# EAGLE board MotorShield (EAGLE 9.0.1)
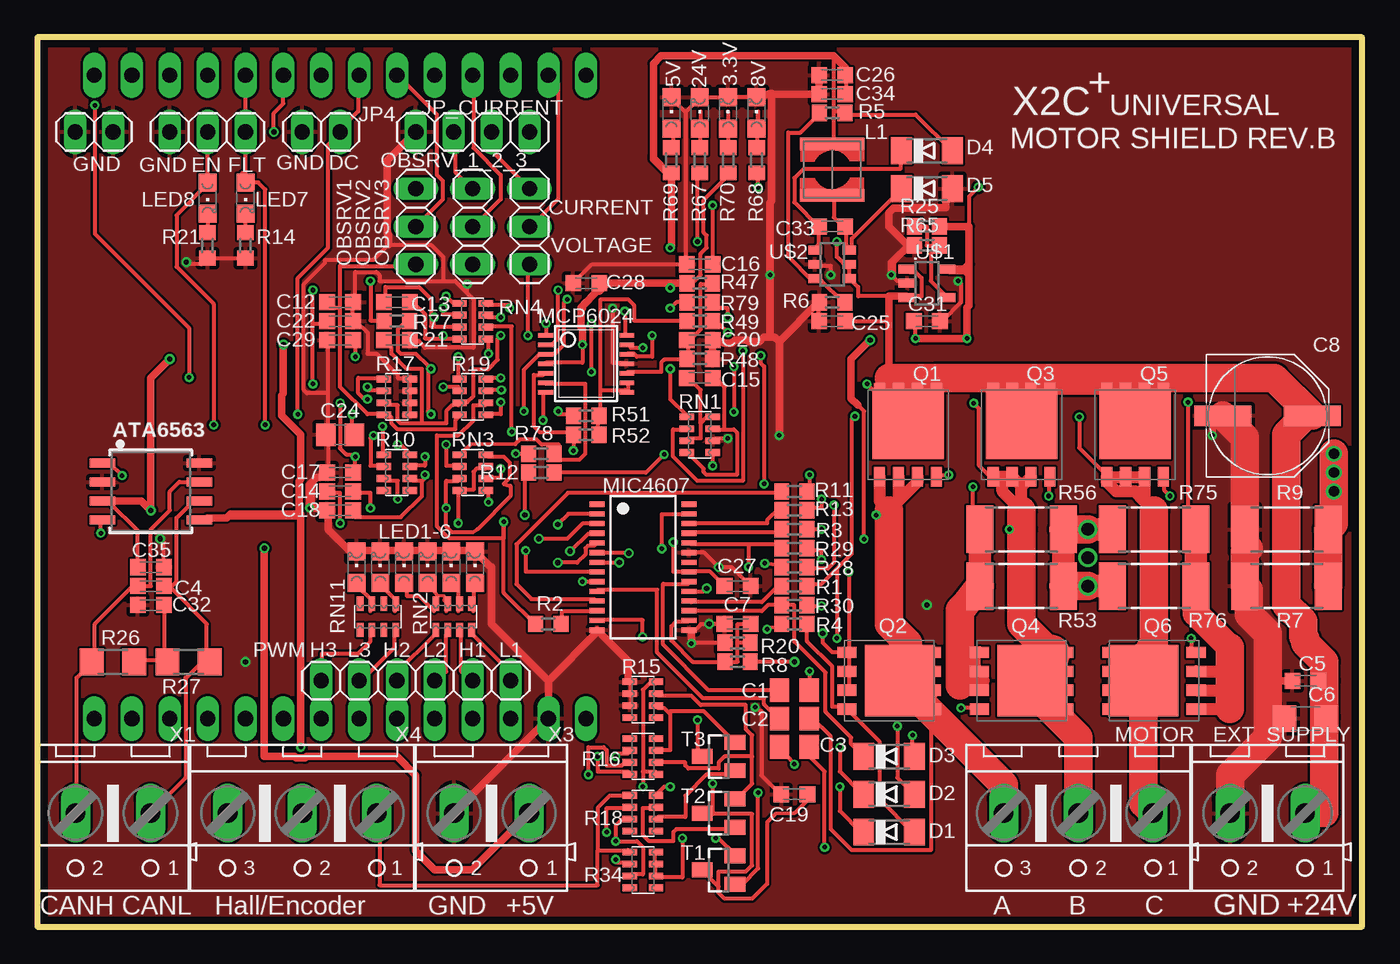
[diagram p2: board, top side]
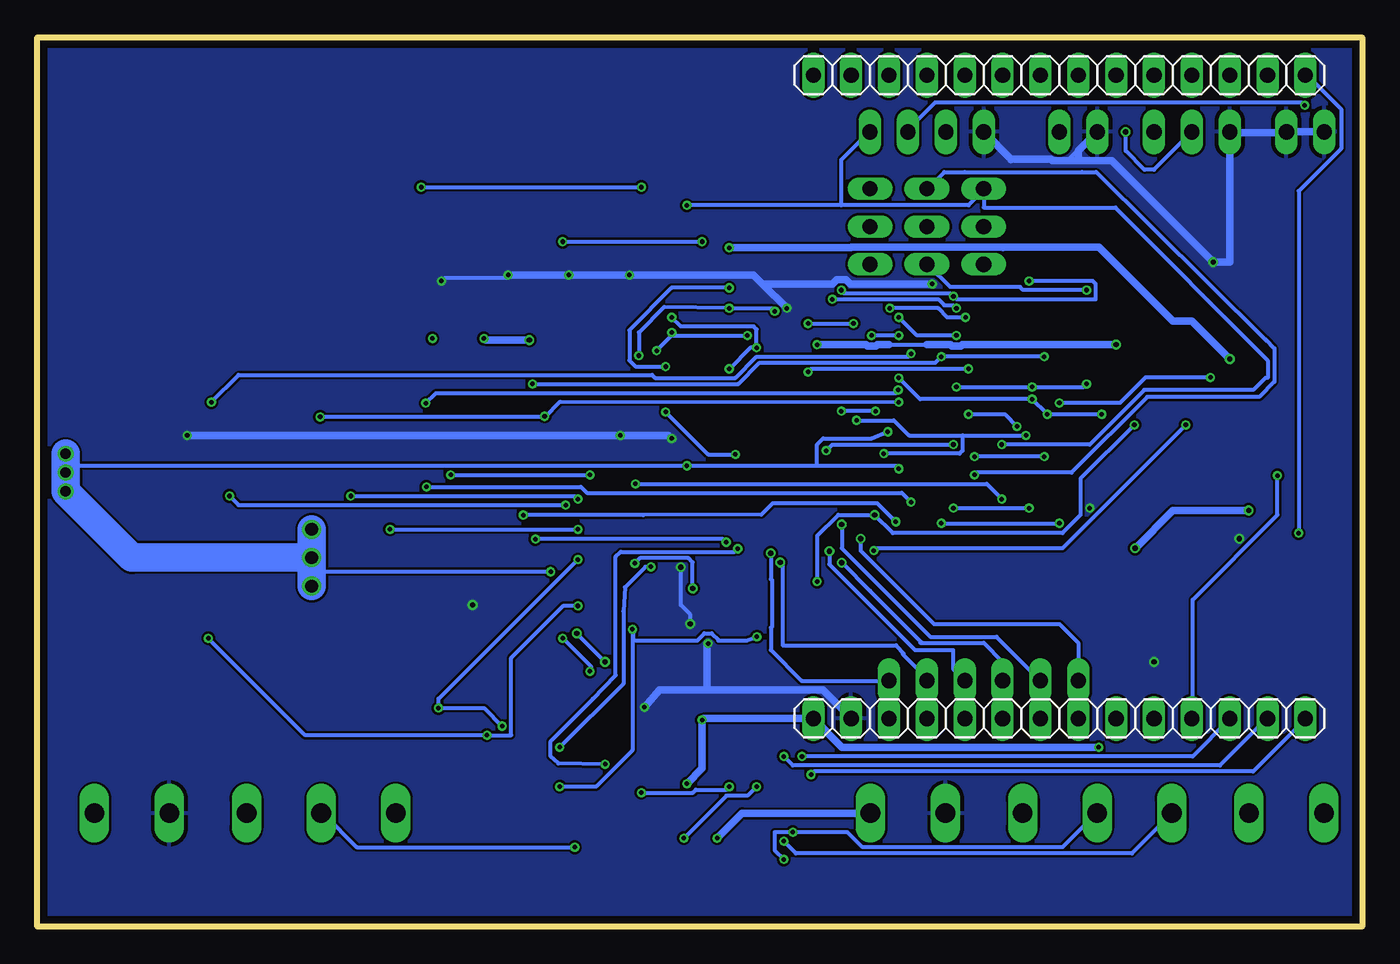
[diagram p3: board, bottom side, seen from below]

Size 88.9 x 59.69 mm. Coordinates in mm from the lower left corner, seen from the top.
Outline: 0,0 88.9,0 88.9,59.69 0,59.69 0,0
Copper layers (1*16): Top 0.035mm / dielectric 1.6mm / Bottom 0.035mm
Design rules "Elecrow_2-layer_PCB_eagle_rule *": minimum track width 10mil, minimum drill 12mil, track to track 6mil, track to pad 6mil, pad to pad 6mil, via to via 8mil, smd to smd 0mil, copper to edge 20mil, drill to drill 10mil, minimum pad ring 6mil, minimum via ring 6mil, stop-mask expansion 0mil, vias tented up to drill 100mil, thermal gap 10mil

## Footprints (pad centres in the part's own frame; a part is rotated, then mirrored left to right if it is on the bottom)
CHIPLED_0805 = smd 1.2 x 1.2: A 0,-1.05; C 0,1.05
SOIC-8 = smd 0.61 x 1.702: 1 -1.905,-3.251; 2 -0.635,-3.251; 3 0.635,-3.251; 4 1.905,-3.251; 5 1.905,3.251; 6 0.635,3.251; 7 -0.635,3.251; 8 -1.905,3.251
C0805K = smd 1.3 x 1.6: 1 -1,0; 2 1,0
C0603K = smd 1.05 x 1.08: 1 -0.875,0; 2 0.875,0
C1206 = smd 1.6 x 1.8: 1 -1.4,0; 2 1.4,0
PANASONIC_E = smd 3.8 x 1.4: + 3,0; - -3,0
C0805 = smd 1.3 x 1.5: 1 -0.95,0; 2 0.95,0
MINIMELF = smd 1.4 x 1.8: A 1.7,0; C -1.7,0
CLL5.08/2 = drill 1.321 long: 1 -2.515,0; 2 2.515,0
1X03 = drill 1.016 long: 1 -2.54,0; 2 0,0; 3 2.54,0
1X02 = drill 1.016 long: 1 -1.27,0; 2 1.27,0
1X04 = drill 1.016 long: 1 -3.81,0; 2 -1.27,0; 3 1.27,0; 4 3.81,0
WE-TPC_3816 = smd 0.85 x 4.3: 1 -1.731,0; 2 1.731,0
1X14 = drill 1.016 long: 1 -16.51,0; 2 -13.97,0; 3 -11.43,0; 4 -8.89,0; 5 -6.35,0; 6 -3.81,0; 7 -1.27,0; 8 1.27,0; 9 3.81,0; 10 6.35,0; 11 8.89,0; 12 11.43,0; 13 13.97,0; 14 16.51,0
TSSOP14 = smd 0.305 x 0.991: 1 -1.905,-2.718; 2 -1.27,-2.718; 3 -0.635,-2.718; 4 0,-2.718; 5 0.635,-2.718; 6 1.27,-2.718; 7 1.905,-2.718; 8 1.905,2.718; 9 1.27,2.718; 10 0.635,2.718; 11 0,2.718; 12 -0.635,2.718; 13 -1.27,2.718; 14 -1.905,2.718
TSSOP28 = smd 0.35 x 1: 1 -4.225,-3.087; 2 -3.575,-3.087; 3 -2.925,-3.087; 4 -2.275,-3.087; 5 -1.625,-3.087; 6 -0.975,-3.087; 7 -0.325,-3.087; 8 0.325,-3.087; 9 0.975,-3.087; 10 1.625,-3.087; 11 2.275,-3.087; 12 2.925,-3.087; 13 3.575,-3.087; 14 4.225,-3.087; 15 4.225,3.087; 16 3.575,3.087; 17 2.925,3.087; 18 2.275,3.087; 19 1.625,3.087; 20 0.975,3.087; 21 0.325,3.087; 22 -0.325,3.087; 23 -0.975,3.087; 24 -1.625,3.087; 25 -2.275,3.087; 26 -2.925,3.087; 27 -3.575,3.087; 28 -4.225,3.087
CLL5.08/3 = drill 1.321 long: 1 -5.004,0; 2 0,0; 3 5.004,0
1X06 = drill 1.016 long: 1 -6.35,0; 2 -3.81,0; 3 -1.27,0; 4 1.27,0; 5 3.81,0; 6 6.35,0
PG-TDSON-8_ = smd 1.3 x 0.75: 1 -2.825,1.905; 2 -2.825,0.635; 3 -2.825,-0.635; 4 -2.825,-1.905; 5 2.825,-1.905; 6 2.825,-0.635; 7 2.825,0.635; 8 2.825,1.905 | smd 4.7 x 4.8: TH 0.725,0
R0603 = smd 1 x 1.1: 1 -0.85,0; 2 0.85,0
R2512 = smd 1.8 x 3.2: 1 -2.8,0; 2 2.8,0
EXBV8V_A = smd 0.45 x 0.965: 1 -1.2,-0.876; 2 -0.4,-0.876; 3 0.4,-0.876; 4 1.2,-0.876; 5 1.2,0.876; 6 0.4,0.876; 7 -0.4,0.876; 8 -1.2,0.876
R1206 = smd 1.6 x 1.803: 1 -1.422,0; 2 1.422,0
SOT23 = smd 1 x 1.4: 1 -0.95,-1.1; 2 0.95,-1.1; 3 0,1.1
TSOT23-5 = smd 0.6 x 1.2: 1 -0.95,-1.3; 2 0,-1.3; 3 0.95,-1.3; 4 0.95,1.3; 5 -0.95,1.3
SOT23-6 = smd 0.6 x 0.9: 1 -0.95,-1.15; 2 0,-1.15; 3 0.95,-1.15; 4 0.95,1.15; 5 0,1.15; 6 -0.95,1.15

## Placement (x,y rotation side)
3.3V  Green  [CHIPLED_0805]  46.35,54.61 0 top
5V  Green  [CHIPLED_0805]  42.55,54.61 0 top
8V  Green  [CHIPLED_0805]  48.26,54.61 0 top
24V  Green  [CHIPLED_0805]  44.45,54.61 0 top
ATA6563  ATA6563  [SOIC-8]  7.62,29.21 270 top
C1  10uF  [C0805K]  50.8,15.88 0 top
C2  10uF  [C0805K]  50.8,13.97 0 top
C3  10uF  [C0805K]  50.8,12.06 0 top
C4  22pF  [C0603K]  7.62,22.86 0 top
C5  100nF  [C0603K]  85.09,16.51 180 top
C6  10uF  [C1206]  85.09,13.97 180 top
C7  1nF  [C0603K]  46.99,20.32 180 top
C8  470u 63V  [PANASONIC_E]  82.55,34.29 0 top
C12  22nF  [C0603K]  20.32,41.91 0 top
C13  1nF  [C0603K]  24.13,41.91 180 top
C14  1nF  [C0603K]  20.32,29.21 0 top
C15  1nF  [C0603K]  44.45,36.83 180 top
C16  1nF  [C0603K]  44.45,44.45 180 top
C17  1nF  [C0603K]  20.32,30.48 180 top
C18  1nF  [C0603K]  20.32,27.94 180 top
C19  1uF  [C0603K]  50.8,8.89 180 top
C20  22nF  [C0603K]  44.45,39.37 0 top
C21  22nF  [C0603K]  24.13,39.37 0 top
C22  22nF  [C0603K]  20.32,40.64 0 top
C24  100n  [C0805]  20.32,33.02 0 top
C25  100nF  [C0603K]  53.34,40.64 180 top
C26  1uF  [C0603K]  53.34,57.15 180 top
C27  100nF  [C0603K]  46.99,22.86 0 top
C28  100nF  [C0603K]  36.83,43.18 180 top
C29  100nF  [C0603K]  20.32,39.37 180 top
C31  4,7uF  [C0603K]  59.69,40.64 0 top
C32  22nF  [C0603K]  7.62,21.59 0 top
C33  100nF  [C0603K]  53.34,46.99 0 top
C34  4,7uF  [C0603K]  53.34,55.88 180 top
C35  4,7uF  [C0603K]  7.62,24.13 0 top
D1  40V  [MINIMELF]  57.15,6.35 0 top
D2  40V  [MINIMELF]  57.15,8.89 0 top
D3  40V  [MINIMELF]  57.15,11.43 0 top
D4  ll4148  [MINIMELF]  59.69,52.07 0 top
D5  40V  [MINIMELF]  59.69,49.53 0 top
EXT_SUPPLY  CLL5.08/2  [CLL5.08/2]  82.55,7.62 180 top
FLT/EN_TP  [1X03]  11.43,53.34 180 top
GND  [1X02]  3.81,53.34 180 top
JP4  [1X02]  19.05,53.34 180 top
JP_CURRENT  [1X04]  29.21,53.34 180 top
L1  4,7uH  [WE-TPC_3816]  53.34,50.8 90 top
LED1  Yellow  [CHIPLED_0805]  29.37,24.13 0 top
LED2  Yellow  [CHIPLED_0805]  27.78,24.13 0 top
LED3  Yellow  [CHIPLED_0805]  26.19,24.13 0 top
LED4  Yellow  [CHIPLED_0805]  24.61,24.13 0 top
LED5  Yellow  [CHIPLED_0805]  23.02,24.13 0 top
LED6  Yellow  [CHIPLED_0805]  21.43,24.13 0 top
LED7  Red  [CHIPLED_0805]  13.97,48.9 180 top
LED8  Red  [CHIPLED_0805]  11.43,48.9 180 top
LEFT  [1X14]  20.32,57.15 0 bottom
MCP6024  MCP6004ST  [TSSOP14]  36.83,37.78 270 top
MIC4607  MIC4607-1  [TSSOP28]  40.64,24.13 270 top
MOTOR  CLL5.08/3  [CLL5.08/3]  69.85,7.62 180 top
OBSRV1  [1X03]  25.4,46.99 270 top
OBSRV2  [1X03]  33.02,46.99 270 top
OBSRV3  [1X03]  29.21,46.99 270 top
PWM_TEST_POINTS  [1X06]  25.4,16.51 180 top
Q1  DMT4002LPS  [PG-TDSON-8_]  58.42,33.02 90 top
Q2  DMT4002LPS  [PG-TDSON-8_]  57.15,16.51 0 top
Q3  DMT4002LPS  [PG-TDSON-8_]  66.04,33.02 90 top
Q4  DMT4002LPS  [PG-TDSON-8_]  66.04,16.51 0 top
Q5  DMT4002LPS  [PG-TDSON-8_]  73.66,33.02 90 top
Q6  DMT4002LPS  [PG-TDSON-8_]  74.93,16.51 180 top
R1  10R  [R0603]  50.8,22.86 0 top
R2  10R  [R0603]  34.29,20.32 180 top
R3  10R  [R0603]  50.8,26.67 0 top
R4  10R  [R0603]  50.8,20.32 0 top
R5  68k 1%  [R0603]  53.34,54.61 0 top
R6  12k 1%  [R0603]  53.34,41.91 180 top
R7  R-EU_SMDR2512  [R2512]  83.82,22.86 0 top
R8  680R  [R0603]  46.99,17.78 180 top
R9  R-EU_SMDR2512  [R2512]  83.82,26.67 0 top
R10  2,2k  [EXBV8V_A]  24.13,30.48 270 top
R11  0R  [R0603]  50.8,29.21 0 top
R12  22k 1%  [R0603]  33.81,30.48 0 top
R13  0R  [R0603]  50.8,27.94 0 top
R14  680R  [R0603]  13.97,45.72 90 top
R15  2,2k  [EXBV8V_A]  40.64,15.24 270 top
R16  200R  [EXBV8V_A]  40.64,11.43 90 top
R17  2,2k  [EXBV8V_A]  24.13,35.56 90 top
R18  2,2k  [EXBV8V_A]  40.64,7.62 270 top
R19  22k  [EXBV8V_A]  29.21,35.56 90 top
R20  680R  [R0603]  46.99,19.05 180 top
R21  680R  [R0603]  11.43,45.72 90 top
R25  68k 1%  [R0603]  59.69,46.99 0 top
R26  60R  [R1206]  5.09,17.78 0 top
R27  60R  [R1206]  10.15,17.78 180 top
R28  0R  [R0603]  50.8,24.13 0 top
R29  10R  [R0603]  50.8,25.4 180 top
R30  10R  [R0603]  50.8,21.59 180 top
R34  2,2k  [EXBV8V_A]  40.64,3.81 270 top
R47  2,2k  [R0603]  44.45,43.18 180 top
R48  2,2k  [R0603]  44.45,38.1 180 top
R49  22k 1%  [R0603]  44.45,40.64 0 top
R51  22k 1%  [R0603]  36.83,34.29 180 top
R52  22k 1%  [R0603]  36.83,33.02 180 top
R53  R-EU_SMDR2512  [R2512]  66.04,22.86 180 top
R56  R-EU_SMDR2512  [R2512]  66.04,26.67 180 top
R65  12k 1%  [R0603]  59.69,45.72 0 top
R67  12,4k 1%  [R0603]  44.45,51.44 270 top
R68  2,2k  [R0603]  48.26,51.44 270 top
R69  680R  [R0603]  42.55,51.44 270 top
R70  330R  [R0603]  46.35,51.44 270 top
R75  R-EU_SMDR2512  [R2512]  74.93,26.67 0 top
R76  R-EU_SMDR2512  [R2512]  74.93,22.86 0 top
R77  22k 1%  [R0603]  24.13,40.64 0 top
R78  22k 1%  [R0603]  33.81,31.75 180 top
R79  22k 1%  [R0603]  44.45,41.91 180 top
RIGHT  [1X14]  20.32,13.97 0 bottom
RN1  2,2k  [EXBV8V_A]  44.45,33.02 90 top
RN2  680R  [EXBV8V_A]  27.94,20.8 0 top
RN3  2,2k  [EXBV8V_A]  29.21,30.48 90 top
RN4  2,2k  [EXBV8V_A]  29.21,40.64 90 top
RN11  680R  [EXBV8V_A]  22.86,20.8 0 top
T1  BSS123  [SOT23]  45.72,3.81 90 top
T2  BSS123  [SOT23]  45.72,7.62 90 top
T3  BSS123  [SOT23]  45.72,11.43 90 top
U$1  MIC5233YM5  [TSOT23-5]  59.69,43.18 270 top
U$2  MCP16301T-E/CH  [SOT23-6]  53.34,44.45 270 top
X1  CLL5.08/2  [CLL5.08/2]  5.08,7.62 180 top
X3  CLL5.08/2  [CLL5.08/2]  30.48,7.62 180 top
X4  CLL5.08/3  [CLL5.08/3]  17.78,7.62 180 top

## Tracks (layer width: path | path; a pad name or v marks a point on that pad's centre or on a via)
+5V  (via drill 0.3, 0.35)
  Top 0.254: 41.34,51.73 42.47,50.6 R69.2 42.47,50.39 v42.47,45.57 | 41.91,58.44 41.86,58.44 | 53.44,54.71 53.44,52.68 L1.2 | 53.44,54.71 53.44,58.42 | 53.44,54.71 54.05,54.71 R5.2 54.25,54.51 58.93,54.51 61.37,52.07 D4.A | R34.8 41.45,4.93 41.45,4.32 R34.7 41.45,4.12 41.45,3.5 R34.6 41.66,3.3 43.28,3.3 v43.28,5.94 | C34.1 54.25,55.88 54.25,57.1 C26.1 | ATA6563.3 4.47,28.45 4.88,28.45 6.71,26.62 6.71,24.18 C35.1 6.71,23.98
  Top 0.508: C26.1 54.22,57.65 53.44,58.42 53.42,58.44 41.91,58.44 | 41.86,58.44 41.34,57.92 41.34,51.73 41.34,51.52 42.47,50.39 | R69.2 42.55,45.64 v42.47,45.57 | X3.1 29.18,3.81 26.67,3.81 25.4,5.08 25.4,10.16 24.13,11.43 18.07,11.43 17.97,11.33 17.38,11.33 17.28,11.43 15.24,11.43 v15.24,25.4 | ATA6563.3 6.99,28.57 v7.62,27.94 7.62,36.83 v8.89,38.1
  Bottom 0.508: v42.47,45.57 34.32,45.57 34.27,45.62 24.15,45.62 | 24.15,45.62 24.1,45.57 | X3.1 41.6,7.62 v43.28,5.94 | 24.15,45.62 17.68,45.62 12.7,40.64 11.43,40.64 v8.89,38.1 | v15.24,25.4 12.7,27.94 v7.62,27.94
+8V  (via drill 0.3, 0.35)
  Top 0.254: v48.36,49.63 48.36,50.39 R68.2 | v58.93,39.47 58.93,40.49 C31.1 58.73,40.49 | v62.38,39.47 62.38,43.74 62.18,43.94 61.16,43.94 U$1.5 | 43.69,23.82 42.67,23.82 v42.67,25.81 | 43.69,23.82 MIC4607.21 | 55.07,35 55.47,34.59 v55.47,26.01 | v63.14,49.63 62.51,49 62.51,46.99 | C27.1 45.15,23.82 43.69,23.82
  Top 0.508: v55.88,39.37 54.61,38.1 54.61,35.46 55.07,35 | v58.93,39.47 v62.38,39.47 62.38,41.56 62.51,41.69 62.51,44.45 | 62.51,44.45 62.51,46.99 R25.2 | U$1.5 62.19,44.13 62.51,44.45
  Bottom 0.254: v63.14,49.63 v48.36,49.63 | v55.47,26.01 42.88,26.01 v42.67,25.81
  Bottom 0.508: v58.93,39.47 58.83,39.37 v55.88,39.37
+24V  (via drill 0.3)
  Top 0.254: v28.25,38.25 28.25,36.83 R19.5 | v21.34,38.25 21.34,39.27 C29.1 | 57.71,35.81 56.69,35.81 Q1.8 56.49,36.02 56.08,36.02 v55.68,36.42 | 57.71,35.81 Q1.7 | 57.71,35.81 Q1.TH | Q1.TH 58.12,35 58.93,35.81 Q1.6 59.13,35.81 60.15,35.81 Q1.5 | 85.95,16.51 C5.1 86.36,16.51 | C6.1 86.56,14.07 86.36,14.07 | 65.23,35.81 64.21,35.81 Q3.8 | 65.23,35.81 Q3.7 | 65.23,35.81 Q3.TH 67.87,35.81 | 67.87,35.81 66.85,35.81 Q3.6 | 67.87,35.81 Q3.5 68.07,35.81 71.73,35.81 Q5.8 71.93,35.81 72.95,35.81 | 72.95,35.81 Q5.7 | 72.95,35.81 Q5.TH 73.36,35 74.17,35.81 Q5.6 74.37,35.81 75.39,35.81 Q5.5 75.59,35.81 | U$1.3 58.52,42.32 59.33,42.32 59.33,43.54 58.93,43.94 58.52,43.94 U$1.1 | 54.46,44.15 54.46,44.35 U$2.5 | 54.46,44.15 54.46,43.54 U$2.4 54.66,43.33 55.07,42.93 55.07,42.32 57.15,42.32 | v44.3,45.97 44.3,50.39 R67.2 | v53.65,45.97 53.65,44.96 54.46,44.15 | 64.01,36.02 Q3.8 | 60.35,36.83 60.35,36.02 Q1.TH | Q3.8 64.21,35.97 64.21,36.83 | C25.1 57.15,40.64
  Top 0.508: U$1.3 58.3,42.32 57.15,42.32 57.15,40.64 57.15,36.83
  Top 1.905: EXT_SUPPLY.1 86.36,7.64 86.36,14.07 86.36,16.51 86.36,17.78 85.09,19.05 85.09,19.32 84.94,19.47 84.94,20.47 83.82,21.59 83.82,33.02 85.09,34.29 C8.+ 83.01,36.83 64.21,36.83 60.35,36.83 57.15,36.83
  Bottom 0.254: v21.34,38.25 v28.25,38.25 28.65,37.85 40.44,37.85 41.86,36.42 v55.68,36.42 | v53.65,45.97 v44.3,45.97
AHB
  Top 0.254: C1.1 45.05,15.88 41.99,18.93 41.99,23.01 43.69,23.01 MIC4607.20
AHO  (via drill 0.3, 0.35)
  Top 0.254: v48.81,24.39 49.78,24.23 R28.1 | MIC4607.19 44.73,22.5 v44.93,22.7
  Bottom 0.254: v44.93,22.7 44.93,24.45 45.22,24.74 48.47,24.74 v48.81,24.39
AHS
  Top 0.254: MIC4607.18 43.89,21.79 48.62,21.79 49.63,22.81 49.78,22.81 R1.1
ALO
  Top 0.254: MIC4607.17 43.89,21.18 48.62,21.18 49.02,21.59 R30.2 50.8,21.59 50.8,19.14 52.89,17.05 52.89,14.42 54.61,12.7 54.61,12.27 D3.C 55.27,11.43
BHB
  Top 0.254: MIC4607.10 37.59,22.61 41.59,22.61 41.59,18.41 44.66,15.34 48.77,15.34 48.77,14.93 49.62,14.07 C2.1
BHO
  Top 0.254: MIC4607.11 37.39,22 33.16,22 32.16,23 32.16,25.67 35.6,29.11 49.78,29.11 R11.1
BHS
  Top 0.254: MIC4607.12 37.39,21.18 35.2,21.18 35.2,20.32 R2.1
BLO  (via drill 0.3)
  Top 0.254: v40.62,19.46 40.62,20.57 37.59,20.57 MIC4607.13 | v48.97,19.96 48.97,20.08 49.78,20.06 R4.1 | v53.85,9.4 53.85,7.77 55.27,6.35 D1.C
  Bottom 0.254: v40.62,19.46 41.31,19.2 43.2,19.2 43.2,19.23 43.66,19.68 44.13,19.68 44.61,19.21 48.91,19.21 48.91,20.12 v48.97,19.96 48.97,11.84 51.41,9.4 v53.85,9.4
CAN_H
  Top 0.254: R26.1 3.66,17.73 2.64,16.71 2.64,7.77 X1.2 | 3.86,17.93 R26.1 | R26.1 3.86,17.88 3.86,20.32 6.3,22.76 6.71,22.76 C4.1 7.62,22.86 7.62,26.67 8.89,27.94 8.89,29.21 9.53,29.84 ATA6563.7 10.77,29.67
CAN_L
  Top 0.254: 9.96,16.71 9.96,16.66 | 9.96,16.66 9.96,10.01 7.72,7.77 X1.1 | 8.94,22.76 8.53,22.76 C4.2 8.94,22.76 | 8.94,22.76 11.38,20.32 11.38,17.88 R27.1 11.38,17.68 10.97,17.68 9.96,16.66 | 8.94,22.76 9.35,23.16 9.35,27.43 10.36,28.45 10.77,28.45 ATA6563.6
CHB  (via drill 0.3)
  Top 0.254: v41.9,25.37 41.9,27.69 43.69,27.69 MIC4607.27 | v50.8,10.9 49.99,11.84 49.99,11.43 C3.1
  Bottom 0.254: v41.9,25.37 42.11,25.16 49.77,25.16 50.09,24.84 50.09,16.88 51.61,15.29 54.46,12.45 54.46,11.43 53.92,10.95 v50.8,10.9
CHO
  Top 0.254: MIC4607.26 43.89,27.08 48.97,27.08 48.97,27.28 49.78,28.09 R13.1
CHS
  Top 0.254: MIC4607.25 43.89,26.47 49.78,26.47 49.78,26.67 R3.1
CLO  (via drill 0.3)
  Top 0.254: 47.73,25.65 49.78,25.65 49.78,25.45 R29.2 | 47.73,25.65 43.89,25.65 MIC4607.24 | v53.85,12.04 53.85,10.41 55.27,8.99 D2.C | 47.73,25.65 v47.73,24.15
  Bottom 0.254: v53.85,12.04 49.58,16.31 49.58,21.18 49.47,22.77 48.09,24.15 v47.73,24.15
DC_BUS  (via drill 0.3)
  Top 0.254: LEFT.7 21.54,57.15 21.54,54.71 20.32,53.49 JP4.1 20.32,53.29 19.51,52.48 19.51,45.57 17.48,43.54 v17.48,34.39 | v22.15,35.41 21.95,35.41 21.54,35.81 21.54,36.83 23.16,36.83 R17.5 | v21.13,34.39 21.13,33.17 C24.2 | v31.09,36.83 30.28,36.83 R19.4
  Bottom 0.254: v31.09,36.83 29.67,35.41 v22.15,35.41 v21.13,34.39 v17.48,34.39
EN  (via drill 0.3, 0.35)
  Top 0.254: v32.77,25.25 32.77,23.82 37.39,23.82 MIC4607.8 | 11.38,53.24 FLT/EN_TP.2 | 11.58,53.44 FLT/EN_TP.2 | FLT/EN_TP.2 LED8.A 11.38,49.78 9.35,47.75 9.35,44.3 11.84,41.81 v11.84,33.68 | v15.88,53.34 15.88,54.61 16.51,55.24 LEFT.9
  Bottom 0.254: FLT/EN_TP.2 13.97,50.8 14.61,50.8 15.88,52.07 v15.88,53.34 | v11.84,33.68 20.12,25.4 32.72,25.4 v32.77,25.25
FLT  (via drill 0.3, 0.35)
  Top 0.254: 37.59,23.22 MIC4607.9 37.39,23.16 v36.58,23.16 | 13.75,50.58 LED7.A | LED7.A FLT/EN_TP.1 LEFT.10 | 14.02,49.78 LED7.A | v32.72,27.64 32.72,30.23 R12.1 | v15.29,33.68 15.29,49.48 14.82,49.95 LED7.A
  Bottom 0.254: v36.58,23.16 36.58,26.21 35.15,27.64 v32.72,27.64 31.5,26.42 20.12,26.42 18.9,27.64 18.9,30.07 v15.29,33.68
GND  (via drill 0.3, 0.35)
  Top 0.254: v53.24,43.74 53.24,44.35 52.22,44.35 U$2.2 | 57.51,43.54 57.71,43.33 58.32,43.33 U$1.2 | v38.61,41.5 38.61,37.85 39.42,37.85 MCP6024.11 | 57.51,43.54 57.51,44.76 | 57.51,43.54 v57.3,43.74 | 61.37,49.43 D5.A | 58.93,45.57 R65.1 | 8V.C 48.16,55.68 46.53,55.68 3.3V.C 46.33,55.68 44.5,55.68 24V.C 44.3,55.47 43.48,54.66 | 43.48,54.66 43.48,44.55 C16.2 37.23,44.45 C28.2 | 43.48,54.66 42.67,55.47 5V.C | 82.55,14.07 83.52,14.07 C6.2 | 45.3,38.14 R48.1 | v46.33,32.77 45.52,32.77 RN1.2 | 48.77,39.57 48.56,39.37 | 45.52,39.27 C20.2 | R17.1 24.99,34.39 24.99,35 R17.2 24.99,35.2 24.99,35.81 R17.3 24.99,36.02 24.99,36.63 R17.4 24.99,36.83 24.18,36.83 24.18,37.03 22.76,38.46 22.15,38.46 22.15,39.88 21.34,40.69 C22.2 21.13,40.69 21.13,41.91 C12.2 21.34,41.91 21.34,43.94 22.76,43.94 22.96,43.74 22.96,43.33 27.23,43.33 | 28.85,42.52 28.04,43.33 27.23,43.33 | 28.85,42.52 29.26,42.11 29.26,38.86 26.01,38.86 25.6,39.27 25.2,39.27 C21.2 | 8.94,53.29 FLT/EN_TP.3 | 27.23,43.33 27.23,44.96 26.42,45.77 23.57,45.77 22.55,44.76 19.3,44.76 19.3,44.55 17.88,43.13 17.88,36.02 18.09,35.81 19.51,35.81 | LED1.C 29.26,25.25 27.84,25.25 LED2.C 27.64,25.25 26.21,25.25 LED3.C 26.01,25.25 | LED4.C 24.59,25.25 23.16,25.25 LED5.C 22.96,25.25 21.54,25.25 LED6.C 21.34,25.25 | 18.49,28.09 19.3,28.09 C18.2 | 18.49,28.09 18.49,29.72 19.15,30.38 19.3,30.53 C17.2 19.51,30.53 19.51,32.97 C24.1 19.51,33.17 19.51,35.81 | 19.51,35.81 19.51,39.27 C29.2 | 18.49,28.09 v18.29,28.09 | R15.3 39.83,14.88 39.83,15.49 R15.2 39.83,15.7 39.83,16.31 R15.1 39.62,16.51 | MIC4607.15 43.89,19.76 44,19.76 44.51,20.26 44.51,20.32 v45.09,20.32 C7.2
  Top 0.254: 43.89,25.04 MIC4607.23 44.74,25.11 v45.72,24.13 46.59,24.13 C27.2 | X3.2 28.04,7.77 34.14,13.87 RIGHT.2 | 28.85,42.52 v28.85,43.13 | v61.77,43.33 61.98,43.13 61.98,41.91 60.76,40.69 C31.2 | 17.88,53.03 JP4.2 | v10,44.61 10.16,44.45 11.01,44.45 R21.1 R14.1 | C25.2 52.43,40.68 52.43,41.91 | v48.16,14.73 48.58,14.46 48.58,10.16 49.53,9.21 49.53,8.89 C19.2 | C35.2 8.49,25.8 v8.26,26.04 | R20.2 43.89,19.05
  Top 0.508: X3.2 27.96,7.64 RIGHT.2 34.29,16.51 | 39.62,16.51 39.62,17.83 MIC4607.14 37.55,19.77 34.29,16.51 | C8.- 78.84,33.58 v78.84,32.97 | v49.78,32.97 49.78,39.27 | 49.78,39.27 52.43,41.91 R6.2 | 49.78,39.27 49.48,39.57 49.17,39.57 | 49.17,39.57 48.77,39.57 | 48.56,39.37 48.46,39.27 47.74,39.27 47.64,39.37 46.83,39.37 46.62,39.17 46.03,39.17 45.93,39.27 45.52,39.27 | C20.2 45.3,39.35 45.3,38.14 | 49.17,39.57 v49.17,43.74 49.17,48.6 49.27,48.7 49.27,55.88 | 49.27,55.88 49.27,55.92 8V.C | v57.3,43.74 57.3,44.55 57.51,44.76 58.47,45.72 | 58.47,45.72 R65.1 | D5.A 60.96,49.1 60.96,48.26 58.9,48.26 58.86,48.22 57.46,48.22 57.15,47.91 57.15,46.99 58.42,45.72 58.47,45.72 | 49.27,55.88 C34.2 C26.2 | 19.3,28.09 v18.29,28.09 18.29,29.69 18.75,30.16 18.93,30.16 19.15,30.38 | C18.2 19.51,27.88 19.51,26.67 20.93,25.25 21.34,25.25 | LED6.C 21.5,25.25 23.16,25.25 | LED5.C 23.09,25.25 24.59,25.25 | LED4.C 24.67,25.25 26.01,25.25 | LED3.C 26.26,25.25 27.84,25.25 | LED2.C 27.85,25.25 29.26,25.25 | LED1.C 30.42,24.13 30.48,24.13 30.48,20.32 34.29,16.51 | v43.89,19 43.89,19.05 43.89,19.76 | 23.57,45.77 23.57,46.4 23.47,46.51 23.47,51.41 JP_CURRENT.4 | JP4.2 17.88,53.24 | C5.2 82.55,16.51
  Top 1.905: EXT_SUPPLY.2 80.03,10.19 82.55,12.7 82.55,14.07 82.55,16.51 82.55,19.68 81.28,20.95 81.28,22.6 R7.1 81.02,25.14 81.28,25.4 81.02,25.66 R9.1 81.02,32.82 C8.-
  Bottom 0.254: 40.44,43.33 v38.61,41.5 | 46.53,32.97 v46.33,32.77 | 23.57,51.46 19.71,51.46 17.88,53.29 JP4.2 | GND.2 2.64,53.29 5.08,53.29 GND.1 | v61.77,43.33 61.57,43.54 57.3,43.54 v57.3,43.74 | v45.09,20.32 45.09,20.95 45.72,21.59 v45.72,24.13
  Bottom 0.508: RIGHT.2 34.29,14.02 36.17,15.9 43.97,15.9 | 43.97,15.9 47.14,15.9 v48.16,14.73 | v78.84,32.97 v49.78,32.97 46.53,32.97 | v57.3,43.74 v53.24,43.74 v49.17,43.74 40.84,43.74 40.23,43.13 | v43.89,19 43.97,18.92 43.97,15.9 | 40.23,43.13 v38.61,41.5 | 40.23,43.13 35.55,43.13 35.24,43.43 34.66,43.43 34.35,43.13 v28.85,43.13 | JP_CURRENT.4 23.57,51.51 | 23.57,51.51 23.57,51.46 | 23.57,51.51 20.91,51.51 20.8,51.41 19.05,51.41 | 5.08,53.29 8.84,53.29 FLT/EN_TP.3 8.89,44.61 v10,44.61 16.8,51.41 19.05,51.41 | GND.1 GND.2 | JP4.2 19.05,52.07 19.05,51.41
  other vias: 59.69,21.59 13.97,17.78
  pour Bottom: 0,59.69 88.9,59.69 88.9,0 0,0
  pour Top: 0,59.69 88.9,59.69 88.9,0 0,0
HALL_1/QEIA  (via drill 0.3)
  Top 0.254: v37.59,11.43 37.59,10.41 39.62,10.41 R16.8
  Bottom 0.254: v37.59,11.43 11.38,11.43 8.94,13.87 RIGHT.12
HALL_1/QEIA_IN
  Top 0.254: 37.59,5.13 39.62,5.13 R34.1 | 37.59,5.13 37.59,7.98 38.41,8.79 39.62,8.79 R18.1 | 37.59,5.13 37.59,2.79 22.96,2.79 22.96,7.57 X4.1
HALL_2/QEIB  (via drill 0.3)
  Top 0.254: v38.81,11.43 38.81,11.63 39.62,11.63 R16.6
  Bottom 0.254: v38.81,11.43 38.2,10.82 9.55,10.82 6.5,13.87 RIGHT.13
HALL_2/QEIB_IN  (via drill 0.3)
  Top 0.254: R34.3 39.83,3.5 40.64,3.5 40.64,5.33 40.23,5.74 v38.81,5.74 38.81,6.76 39.22,7.16 39.62,7.16 R18.3
  Bottom 0.254: v38.81,5.74 38,4.93 15.44,4.93 12.8,7.57 X4.3
HALL_3/QEIINDEX  (via drill 0.3)
  Top 0.254: v36.98,10.21 36.98,12.04 38,12.04 38.2,11.84 38.2,10.82 39.22,10.82 39.42,11.02 39.62,11.02 R16.7
  Bottom 0.254: v36.98,10.21 36.78,10.41 7.32,10.41 3.86,13.87 RIGHT.14
HALL_3/QEIINDEX_IN  (via drill 0.3)
  Top 0.254: v38.81,4.52 38.81,4.32 39.62,4.32 R34.2 | v38.2,6.35 38.2,7.98 39.62,7.98 R18.2
  Bottom 0.254: v38.81,4.52 39.42,5.13 39.42,6.35 v38.2,6.35 34.54,6.35 33.53,5.33 20.12,5.33 17.88,7.57 X4.2
ILIM+
  Top 0.254: 43.89,20.57 MIC4607.16 43.65,20.48 42.86,20.48 42.55,20.16 42.55,19.21 43.97,17.78 R8.2 46.99,17.78 46.99,19.05 | R20.1 46.99,19.05 | 46.99,19.05 46.99,20.32 C7.1
N$1  (via drill 0.3)
  Top 0.254: v51.82,30.33 51.82,29.31 R11.2 | v61.16,30.33 60.35,30.33 Q1.4
  Bottom 0.254: v61.16,30.33 v51.82,30.33
N$2  (via drill 0.3)
  Top 0.254: v27.23,41.5 27.23,41.1 28.25,41.1 RN4.6 | v35.56,42.11 35.36,41.91 35.36,39.06 34.75,38.46 34.14,38.46 MCP6024.3 33.93,38.46 33.73,38.46 32.65,37.38 v32.65,34.59 | v34.95,34.59 34.95,34.39 35.97,34.39 R51.2
  Bottom 0.254: v27.23,41.5 27.43,41.71 28.04,41.71 28.45,42.11 v35.56,42.11 | v32.65,34.59 v34.95,34.59
N$3  (via drill 0.3)
  Top 0.254: v24.18,28.7 24.18,29.92 23.37,29.92 R10.3 | v48.77,29.72 48.77,37.59 48.54,37.84 v48.54,38.33 | v42.47,41.5 42.88,41.91 R79.2 | v39.42,41.3 39.42,39.67 MCP6024.14
  Bottom 0.254: v24.18,28.7 25.2,29.72 v48.77,29.72 | v48.54,38.33 48.54,39.88 46.83,41.59 v42.47,41.5 39.62,41.5 v39.42,41.3
N$4  (via drill 0.3)
  Top 0.254: v22.55,32.97 22.35,32.77 22.35,30.94 23.16,30.94 R10.2 | v33.93,33.98 33.93,35.81 MCP6024.7 | v32.11,31.75 R78.2
  Bottom 0.254: 26.82,32.97 30.41,32.97 31.43,33.98 v33.93,33.98 | 26.82,32.97 v22.55,32.97 | v32.11,31.75 27.03,31.75 26.82,31.95 26.82,32.97
N$6
  Top 0.254: LED8.C R21.2
N$8
  Top 0.254: R14.2 LED7.C
N$9  (via drill 0.3)
  Top 0.254: v27.43,32.36 27.43,30.94 28.25,30.94 RN3.6 | v35.97,31.95 35.97,32.97 R52.2 35.97,33.17 33.73,33.17 33.33,33.58 33.33,37.03 33.93,37.03 MCP6024.5
  Bottom 0.254: v27.43,32.36 35.56,32.36 v35.97,31.95
N$12
  Top 0.254: L1.1 53.44,49.02 53.44,47.6 54.05,46.99 C33.2 54.25,46.99 54.25,45.77 54.46,45.57 U$2.6 54.66,45.57 54.66,46.18 57.91,49.43 D5.C
N$14
  Top 0.254: 60.55,45.77 R65.2 | U$1.4 60.96,42.32 59.94,43.33 59.94,45.16 60.35,45.57 R65.2 | R25.1 59.69,46.99 59.69,45.72 R65.2
N$15  (via drill 0.3)
  Top 0.254: v47.35,38.66 47.35,29.92 44.3,29.92 42.67,31.55 42.67,33.38 43.48,33.38 RN1.6 | v46.33,39.88 45.72,40.49 45.31,40.49 R49.2 | v41.25,39.67 41.25,38.25 40.23,38.25 40.03,38.46 39.62,38.46 MCP6024.12
  Bottom 0.254: 46.33,39.67 v47.35,38.66 | 46.33,39.67 v41.25,39.67 | 46.33,39.67 v46.33,39.88
N$16
  Top 0.254: 42.47,14.28 42.47,11.84 41.66,11.84 R16.3 | 42.47,14.28 42.06,14.68 41.66,14.68 R15.6 | 42.47,14.28 42.47,14.48 44.7,14.48 46.74,12.45 T3.2
N$17
  Top 0.254: 47.95,11.43 46.13,11.43 45.72,11.02 45.72,10.62 43.69,10.62 43.48,10.82 43.48,11.02 41.66,11.02 R16.2 | 47.95,11.43 47.95,9.6 46.94,8.59 T2.2 | 47.95,11.43 47.95,12.85 47.55,13.26 47.55,14.88 44.5,14.88 43.89,15.49 41.66,15.49 R15.7
N$18  (via drill 0.3)
  Top 0.254: 40.64,10.41 41.45,10.41 R16.1 | 40.64,10.41 40.64,15.9 41.05,16.31 41.45,16.31 R15.8 | v45.52,5.94 45.72,5.94 46.74,4.93 T1.2 | 40.64,10.41 v40.64,9.4
  Bottom 0.254: v45.52,5.94 42.67,8.79 41.25,8.79 v40.64,9.4
N$19  (via drill 0.3)
  Top 0.254: v42.47,9.4 42.06,9.4 41.66,8.99 R18.8 | v48.36,8.99 48.36,3.91 47.35,2.9 46.94,2.9 T1.1
  Bottom 0.254: v42.47,9.4 42.67,9.2 44.7,9.2 44.91,8.99 v48.36,8.99
N$20
  Top 0.254: R18.7 41.45,7.98 40.64,7.98 40.64,6.15 41.05,5.74 42.67,5.74 42.67,6.35 42.88,6.55 46.74,6.55 T2.1
N$21  (via drill 0.3)
  Top 0.254: v52.63,28.7 52.63,28.09 51.82,28.09 R13.2 | v67.87,28.91 67.87,30.12 Q3.4
  Bottom 0.254: v52.63,28.7 52.83,28.91 v67.87,28.91
N$22  (via drill 0.3)
  Top 0.254: v53.44,28.3 53.44,24.43 53.03,24.03 51.82,24.03 R28.2 | v76,28.91 75.59,29.31 75.59,30.12 Q5.4
  Bottom 0.254: v53.44,28.3 75.39,28.3 v76,28.91
N$23
  Top 0.254: R18.6 41.66,7.37 43.48,7.37 43.48,8.79 44.91,10.21 46.74,10.21 46.74,10.41 T3.1
N$24
  Top 0.254: RN2.8 26.62,21.18 25.6,22.2 24.79,22.2 24.79,23.01 LED4.A
N$25
  Top 0.203: 26.83,22.23 27.3,22.23 27.3,21.92
  Top 0.254: 26.83,22.23 26.21,23.01 LED3.A | 27.3,21.92 27.43,21.79 27.43,21.18 RN2.7
N$26
  Top 0.254: RN2.6 28.25,21.18 28.25,22.61 27.84,23.01 LED2.A
N$27
  Top 0.254: R67.1 44.5,53.7 44.5,54.71 24V.A
N$28
  Top 0.254: R68.1 48.36,53.7 48.36,54.71 8V.A
N$29
  Top 0.254: 54.25,14.48 Q2.4 | D1.A 58.73,6.35 56.49,8.59 56.49,12.45 54.46,14.48 Q2.4 | Q2.4 54.17,14.76 53.34,14.76 53.34,17.46 51.65,19.15 R4.2
N$30
  Top 0.254: R69.1 42.67,52.43 42.67,53.44 5V.A
N$31
  Top 0.254: R70.1 46.33,53.7 46.33,54.71 3.3V.A
N$32  (via drill 0.3)
  Top 0.254: v52.63,24.64 52.63,25.25 51.82,25.25 R29.1 | v61.98,14.68 63.2,14.68 Q4.4 | v57.71,13.46 57.71,10.01 58.73,8.99 D2.A
  Bottom 0.254: v52.63,24.64 61.98,15.29 v61.98,14.68 58.93,14.68 v57.71,13.46
N$33  (via drill 0.3)
  Top 0.254: 26.62,40.28 26.42,40.28 26.42,42.11 25.6,42.93 23.37,42.93 23.37,41.91 C13.2 | 26.62,40.28 28.25,40.28 RN4.7 | v31.7,41.5 31.7,41.71 30.28,41.71 RN4.4 | 26.62,40.28 v26.62,40.89
  Bottom 0.254: v31.7,41.5 28.45,41.5 27.84,40.89 v26.62,40.89
N$34  (via drill 0.3)
  Top 0.254: 27.23,39.47 26.01,39.47 26.01,41.1 25.2,41.91 C13.1 | 27.23,39.47 28.25,39.47 RN4.8 | v31.09,40.89 30.28,40.89 RN4.3 | 27.23,39.47 v27.23,39.67
  Bottom 0.254: v31.09,40.89 29.87,39.67 v27.23,39.67
N$35  (via drill 0.3)
  Top 0.254: v27.43,42.32 27.84,41.91 28.25,41.91 RN4.5 | v34.95,42.72 34.95,39.47 34.54,39.06 34.14,39.06 MCP6024.2 | v22.35,43.33 22.35,40.69 23.16,40.69 R77.1
  Bottom 0.254: v34.95,42.72 34.75,42.52 27.64,42.52 v27.43,42.32 27.23,42.11 17.88,42.11 17.88,43.13 18.09,43.33 v22.35,43.33
N$36
  Top 0.254: RN2.5 29.26,21.18 29.26,23.01 LED1.A
N$37  (via drill 0.3)
  Top 0.254: RN3.7 28.25,29.92 27.43,29.92 v27.43,28.09 27.43,26.87 27.84,26.47 29.23,26.47 29.53,26.67 31.75,28.89 31.75,29.58 31.29,29.72 31.7,30.12 31.7,31.14 31.29,31.55 30.28,31.55 RN3.4 | v22.35,28.09 22.35,29.11 21.34,29.11 C14.2
  Bottom 0.254: v27.43,28.09 v22.35,28.09
N$38  (via drill 0.3)
  Top 0.254: RN3.3 30.07,30.73 29.46,30.73 29.26,30.53 29.26,29.31 28.45,29.31 RN3.8 28.25,29.11 v28.25,27.08 | v20.32,27.08 20.32,29.11 19.51,29.11 C14.1
  Bottom 0.254: v28.25,27.08 v20.32,27.08
N$39
  Top 0.254: RN11.5 23.98,21.18 23.98,22 23.16,22.81 23.16,23.01 LED5.A
N$40
  Top 0.254: RN11.7 22.35,21.18 22.35,22 21.54,22.81 21.54,23.01 LED6.A
N$44
  Top 0.254: R6.1 54.05,41.91 52.63,43.33 52.22,43.33 U$2.3 52.02,43.33 50.39,44.96 50.39,53.29 51.21,53.29 52.43,54.51 R5.1
N$45
  Top 0.254: 35,31.75 35,31.34 36.37,31.34 36.78,31.75 36.78,36.42 34.14,36.42 MCP6024.6 | 35,31.75 35,32.36 33.84,32.36 33.5,32.7 32.38,32.7 32.07,32.38 29.06,32.36 28.45,31.75 RN3.5 | R78.1 35,31.75
N$47
  Top 0.254: 44.5,33.78 44.5,32.77 43.69,32.77 RN1.7 | 44.5,33.78 44.91,34.19 45.31,34.19 RN1.4 | 44.5,33.78 44.5,36.02 43.69,36.83 C15.2
N$48
  Top 0.254: 46.13,33.38 45.52,33.38 RN1.3 | 46.13,33.38 46.74,33.38 46.94,33.17 46.94,30.33 44.91,30.33 44.7,30.53 44.7,30.73 43.69,31.75 RN1.8 | 46.13,33.38 46.13,36.22 45.52,36.83 C15.1
N$49  (via drill 0.3)
  Top 0.254: v42.47,37.44 42.47,35.41 43.48,34.39 RN1.5 | v40.64,38.86 39.83,38.86 39.62,39.06 MCP6024.13 | v46.33,40.89 46.33,41.5 45.72,41.5 45.31,41.91 R79.1
  Bottom 0.254: v42.47,37.44 41.05,38.86 v40.64,38.86 40.64,40.08 40.84,40.28 45.72,40.28 v46.33,40.89
N$52
  Top 0.254: 52.43,46.99 52.43,45.77 52.22,45.57 U$2.1 | 52.43,46.99 50.8,48.62 50.8,50.24 51.41,50.85 57.91,50.85 57.91,52.07 D4.C | 52.43,46.99 C33.1
N$56
  Top 0.254: 6.71,17.93 R26.2 6.71,17.88 8.53,17.88 | 8.53,17.88 8.53,21.54 C32.2 | 8.53,17.88 R27.2
N$58  (via drill 0.3)
  Top 0.254: v52.63,21.53 52.47,21.5 52.06,21.5 51.82,21.59 R30.1 | v58.73,12.85 58.73,11.43 D3.A | v77.42,19.36 77.42,18.75 77.62,18.54 Q6.4
  Bottom 0.254: v52.63,21.53 52.76,21.55 53.58,21.55 57.1,18.03 57.1,12.85 v58.73,12.85 70.92,12.85 v77.42,19.36
N$60  (via drill 0.3)
  Top 0.254: v23.16,33.58 23.16,31.75 R10.1 | v26.42,34.39 26.21,34.59 26.21,37.44 | 26.21,37.44 26.21,37.64 25.4,38.46 24.38,38.46 24.18,38.66 24.18,40.08 24.79,40.69 R77.2 | v34.14,40.49 34.14,39.67 MCP6024.1 | v37.19,37.24 v37.19,40.49 | 26.21,37.44 v26.42,37.44
  Bottom 0.254: v23.16,33.58 23.98,34.39 v26.42,34.39 | v37.19,40.49 v34.14,40.49 | v37.19,37.24 36.98,37.44 v26.42,37.44
N$66
  Top 0.254: MCP6024.10 39.62,37.24 41.86,37.24 41.86,37.85 42.06,38.05 43.48,38.05 R48.2 43.69,38.25 43.69,39.27 | 43.69,39.27 44.5,40.08 44.5,43.13 45.11,43.13 R47.1 | 43.69,39.27 C20.1
P_A  (via drill 0.3)
  Top 0.254: Q6.8 72.14,14.68 72.14,15.7 Q6.7 72.14,15.9 72.14,17.12 Q6.6 72.14,17.32 | 72.14,17.32 72.14,18.34 Q6.5 | 72.14,17.32 72.95,17.32 Q6.TH | v31.09,35.2 31.09,34.39 30.28,34.39 R19.1 | v54.86,34.25 54.66,34.05 54.66,25.04 53.65,24.03 | 53.65,24.03 52.63,23.01 51.82,23.01 R1.2 | v51.82,17.14 51.82,16.51 C1.2 | 53.65,24.03 v53.65,19.36 | v69.92,34.21 69.92,32.14 71.53,30.53 Q5.1
  Top 0.813: 74.93,27.94 74.3,28.57 | 74.3,28.57 73.66,29.21 72.39,29.21 71.75,29.84 Q5.1 Q5.2 Q5.3 74.3,28.57
  Top 1.905: 74.2,17.78 74.93,19.05 74.93,27.94 | Q6.TH 74.2,8.27 MOTOR.1
  Top 2.54: Q6.TH 74.2,17.78
  Bottom 0.254: v31.09,35.2 53.82,35.24 54.81,34.25 v54.86,34.25 54.91,34.21 v69.92,34.21 | v51.82,17.14 51.75,17.2 51.75,17.46 53.66,19.37 53.56,19.36 v53.65,19.36
P_B  (via drill 0.3)
  Top 0.254: C2.2 51.98,14.03 53.24,12.76 53.24,6.55 54.66,5.13 59.94,5.13 59.94,13.26 60.53,13.85 | R19.2 30.07,35 29.26,35 29.26,33.98 28.25,32.97 26.82,32.97 26.82,26.87 27.64,26.06 31.29,26.06 v31.29,27.18 31.29,22.4 32.11,21.59 R2.2 | v56.29,27.63 57.15,25.25
  Top 0.813: Q1.1 56.52,28.57 57.15,27.94 57.78,28.57 | Q1.2 57.78,28.57 | Q1.3 59.05,29.84 57.78,28.57 | 58.42,17.05 Q2.TH 59.34,16.51 | 58.42,17.05 58.42,17.23 | Q2.8 58.62,17.05 58.42,17.05 | 59.34,16.51 Q2.6 59.98,15.53 59.42,14.97 59.78,14.61 Q2.5 | Q2.7 59.34,16.51
  Top 1.905: 58.42,17.23 58.42,19.05 57.15,20.32 57.15,25.25 57.15,27.94 | Q2.TH 59.42,14.97 60.53,13.85 64.85,9.54 MOTOR.3
  Bottom 0.254: v56.29,27.63 48.23,27.63 40.32,27.65 39.55,28.42 32.54,28.42 v31.29,27.18
P_C  (via drill 0.3)
  Top 0.254: v31.13,36.02 30.28,36.02 R19.3 | v62.83,35.13 63.2,34.77 63.2,30.94 63.8,30.33 Q3.1 | v52.63,26.67 R3.2 | v65.23,26.67 66.04,26.67 | Q4.5 68.89,14.68 Q4.TH | Q4.6 68.68,15.7 68.68,15.09 Q4.TH | Q4.7 68.68,17.32 Q4.TH | Q4.8 68.89,18.54 Q4.TH | v52.83,5.33 52.83,10.41 51.82,11.43 C3.2
  Top 0.813: 66.04,29.56 66.04,27.94 64.77,29.21 64.77,30.2 | 66.04,29.56 Q3.3 | 66.04,29.56 Q3.2 64.77,30.2 | 64.77,30.2 Q3.1
  Top 1.905: 68.03,18.32 66.04,20.32 66.04,26.67 66.04,27.94 | Q4.TH 66.77,15.79 69.85,12.7 MOTOR.2
  Top 2.54: Q4.TH 68.03,18.32
  Bottom 0.254: v31.13,36.02 31.34,35.81 62.15,35.81 v62.83,35.13 | v65.23,26.67 v52.63,26.67 | v52.83,5.33 67.46,5.33 69.7,7.57 MOTOR.2
PHASE_CUR_1  (via drill 0.3)
  Top 0.254: v24.18,32.36 24.38,32.36 24.99,31.75 R10.8 | v45.31,48.41 45.31,44.55 C16.1
  Bottom 0.254: v24.18,32.36 18.29,32.36 14.63,36.02 7.32,36.02 6.5,36.83 6.35,36.83 6.35,38.01 6.5,38.16 16.56,48.26 25.4,48.26 25.4,49.43 | 34.95,48.41 26.42,48.41 25.4,49.43 | 34.95,48.41 v45.31,48.41 | 25.4,49.43 OBSRV1.1 | 34.95,48.41 34.95,51.46 33.12,53.29 JP_CURRENT.1
PHASE_CUR_2  (via drill 0.3)
  Top 0.254: v26.01,31.55 26.01,30.94 25.2,30.94 R10.7 | C17.1 21.34,30.53 v21.34,31.55 21.34,31.7 20.73,31.7 20.32,32.11 v20.32,35.15 | OBSRV2.1 30.48,52.07 JP_CURRENT.2 | v10.19,36.86 10.19,40.18 3.86,46.51 v3.86,55.12
  Bottom 0.254: v21.34,31.55 v26.01,31.55 | v3.86,55.12 4.06,55.32 28.65,55.32 30.48,53.49 JP_CURRENT.2 | v20.32,35.15 16.26,35.15 14.54,36.87 13.99,36.87 v10.19,36.86
PHASE_CUR_SUM  (via drill 0.3)
  Top 0.254: 25.81,29.92 25.2,29.92 R10.6 | 25.81,29.92 25.81,28.91 24.38,27.48 21.34,27.48 21.34,27.89 C18.1 | OBSRV3.1 29.06,49.63 28.04,50.65 28.04,53.29 JP_CURRENT.3 | 25.81,29.92 26.01,30.12 v26.01,30.33
  Bottom 0.254: OBSRV3.1 29.06,49.63 28.04,50.65 26.67,50.64 18.8,50.64 17.84,50.65 6.51,39.42 | 6.41,39.33 6.51,39.42 | v26.01,30.33 26.01,30.48 19.51,30.48 14.43,35.56 6.91,35.56 5.89,36.58 5.89,38.81 6.5,39.42 6.51,39.42
PHASE_I_V_1
  Top 0.254: OBSRV1.2 27.23,48.82 27.23,50.04 26.82,50.44 26.82,54.51 24.18,57.15 LEFT.6
PHASE_I_V_2
  Top 0.254: OBSRV2.2 33.12,46.99 34.95,48.82 34.95,56.54 34.34,57.15 LEFT.2
PHASE_I_V_3
  Top 0.254: OBSRV3.2 29.26,46.99 31.09,48.82 31.09,50.44 29.26,52.27 29.26,57.15 LEFT.4
PHASE_VOLT_1
  Top 0.254: R19.8 28.25,34.19 28.04,33.98 28.04,33.38 24.18,33.38 23.77,33.78 23.77,34.19 23.37,34.19 R17.8 23.16,34.39 22.15,34.39 20.32,36.22 20.32,41.5 | 20.32,41.5 19.91,41.5 19.51,41.91 C12.1 | 20.32,41.5 20.32,44.35 25.4,44.35 OBSRV1.3
PHASE_VOLT_2  (via drill 0.3)
  Top 0.254: 25.81,33.78 27.43,33.78 27.43,34.59 27.84,35 28.25,35 R19.7 28.45,35.2 28.85,35.2 29.26,35.61 29.26,37.44 30.28,37.44 30.89,38.05 30.89,39.47 v31.09,39.67 | 25.81,33.78 24.38,33.78 24.18,33.98 24.18,35 23.37,35 R17.7 | 25.81,33.78 25.81,37.44 24.79,37.44 23.77,38.46 23.77,38.86 23.37,39.27 C21.1 | v32.92,39.67 32.92,44.35 OBSRV2.3
  Bottom 0.254: v31.09,39.67 v32.92,39.67
PHASE_VOLT_3  (via drill 0.3)
  Top 0.254: v22.15,36.22 22.15,36.02 23.16,36.02 R17.6 | v27.23,36.22 28.25,36.22 28.25,36.02 R19.6 | 18.49,40.49 19.3,40.49 C22.1 | v18.49,36.42 18.49,40.49 | 18.49,40.49 v18.49,42.72
  Bottom 0.254: v27.23,36.22 v22.15,36.22 18.69,36.22 v18.49,36.42 | v18.49,42.72 22.76,42.72 22.96,42.93 27.64,42.93 29.06,44.35 OBSRV3.3
PWM1_H  (via drill 0.35)
  Top 0.254: RN2.3 28.45,19.56 28.45,17.12 29.06,16.51 PWM_TEST_POINTS.2 29.26,16.51 29.26,14.07 RIGHT.4 | MIC4607.7 v39.05,24.45
  Bottom 0.254: v39.05,24.45 38.89,24.29 38.89,18.89 31.29,18.89 30.75,18.31 30.84,18.31 29.04,16.51 PWM_TEST_POINTS.2
PWM1_L  (via drill 0.35)
  Top 0.254: 31.7,16.51 31.7,17.12 29.26,19.56 RN2.4 | 31.7,16.51 31.7,14.07 RIGHT.3 | 31.7,16.51 PWM_TEST_POINTS.1 | MIC4607.6 39.64,25.11 v39.69,25.06
  Bottom 0.254: v39.69,25.06 39.69,23.33 39.6,23.24 39.6,20.15 39.69,20.06 39.69,18.57 37.62,16.51 PWM_TEST_POINTS.1
PWM2_H  (via drill 0.35)
  Top 0.254: 24.18,16.51 24.18,17.12 26.62,19.56 RN2.1 | 24.18,16.51 24.18,14.07 RIGHT.6 | 24.18,16.51 PWM_TEST_POINTS.4 | v34.92,24.43 36.23,24.43 36.77,24.98 36.77,25.4 36.94,25.56 37.36,25.56 MIC4607.5
  Bottom 0.254: v34.92,24.43 33.02,22.54 29.53,19.05 | 29.65,19.05 29.53,19.05 | 29.53,19.05 25.4,19.05 24.13,17.78 PWM_TEST_POINTS.4
PWM2_L  (via drill 0.35)
  Top 0.254: RN2.2 27.43,19.56 27.43,17.12 26.82,16.51 PWM_TEST_POINTS.3 26.62,16.51 26.62,14.07 RIGHT.5 | MIC4607.4 37.2,26.37 36.96,26.37 35.79,25.2 v35.76,25.2
  Bottom 0.254: v35.76,25.2 35.76,24.32 30,18.57 27.46,18.57 27.46,17.3 PWM_TEST_POINTS.3
PWM3_H  (via drill 0.35)
  Top 0.254: 19.1,16.51 19.1,18.34 21.54,18.34 22.35,19.15 22.35,19.56 RN11.2 | 19.1,16.51 19.1,14.07 RIGHT.8 | 19.1,16.51 PWM_TEST_POINTS.6 | MIC4607.3 36.58,27.05 35.56,26.04 v33.66,26.04
  Bottom 0.254: v33.66,26.04 33.66,25.24 28.73,20.32 20.32,20.32 19.05,19.05 PWM_TEST_POINTS.6
PWM3_L  (via drill 0.35)
  Top 0.254: RN11.4 23.98,19.56 23.98,18.75 21.74,16.51 PWM_TEST_POINTS.5 21.54,16.51 21.54,14.07 RIGHT.7 | MIC4607.2 35.64,27.7 v34.92,26.99
  Bottom 0.254: v34.92,26.99 34.92,25.4 28.98,19.46 24.54,19.46 PWM_TEST_POINTS.5
RXD_CAN  (via drill 0.3)
  Top 0.254: 3.86,57.15 LEFT.14 | v4.27,26.42 4.27,27.23 ATA6563.4
  Bottom 0.254: v4.27,26.42 4.27,49.38 1.42,52.22 1.42,54.86 3.66,57.1 LEFT.14
SHUNT_HIGH_1  (via drill 0.3)
  Top 0.254: v30.28,38.46 30.28,39.27 RN4.1 | v77.22,35.2 77.22,27.08 R75.2
  Top 0.813: 77.73,22.6 R76.2 | Q6.2 80.01,15.88 | Q6.1 80.01,14.61 | Q6.3 79.38,17.14 80.01,17.78
  Top 1.524: R75.2 R76.2 | 77.73,22.36 77.73,22.6
  Top 1.778: 77.73,22.36 77.73,21.01 80.01,18.73
  Top 1.905: 80.01,14.61 80.01,15.88 80.01,17.78 80.01,18.73
  Bottom 0.254: v30.28,38.46 30.48,38.25 40.64,38.25 42.06,36.83 47.45,36.83 47.65,37.03 75.39,37.03 v77.22,35.2
SHUNT_HIGH_2  (via drill 0.3)
  Top 0.254: v30.28,28.5 30.28,29.11 RN3.1 | v62.79,29.52 62.79,27.28 R56.2
  Top 0.813: Q4.1 62.87,18.41 62.87,17.14 Q4.2 62.58,16.51 63.5,16.51 | 63.5,16.51 61.91,16.19 | Q4.3 62.87,15.88 63.5,16.51
  Top 1.524: R56.2 R53.2
  Top 1.905: R53.2 63.18,22.8 62.23,21.59 61.91,21.27 61.91,16.19
  Bottom 0.254: v30.28,28.5 30.89,29.11 52.02,29.11 52.43,29.52 v62.79,29.52
SHUNT_HIGH_SUM  (via drill 0.3, 0.35, 0.7, 0.85)
  Top 0.254: v31.09,30.73 31.09,30.12 30.28,30.12 RN3.2 | v45.31,30.94 45.31,31.75 RN1.1 | v31.83,33.22 31.83,40.28 30.28,40.28 RN4.2 | Q2.3 54.46,15.9 54.46,17.12 Q2.2 54.46,17.32 54.46,18.34 Q2.1 | 54.25,18.54 Q2.1 | v54.46,23.82 54.46,18.54 Q2.1 | Q2.1 53.34,18.41 52.7,19.05 v52.7,19.68 | v50.8,17.78 R8.1
  Top 1.524: R56.1 R53.1 | v70.48,26.67 R75.1 | R76.1 v70.48,22.86
  Top 1.905: R53.1 v70.48,22.86 | R56.1 v70.48,26.67 | v87,31.75 87,27.05 R9.2 R7.2
  Bottom 0.254: v31.09,30.73 31.29,30.94 36.58,30.94 | 36.58,30.94 v45.31,30.94 87,30.94 | v31.83,33.22 32.92,32.77 36.17,32.77 36.58,32.36 36.58,30.94 | 70.48,23.82 v54.46,23.82 | v52.7,19.68 v50.8,17.78
  Bottom 1.905: v70.48,26.67 v70.48,24.77 | v70.48,24.77 70.48,23.82 v70.48,22.86 | v70.48,24.77 82.55,24.77 v87,29.21 v87,30.48 87,30.94 v87,31.75
TXD_CAN  (via drill 0.3)
  Top 0.254: v5.69,30.28 4.88,31.09 4.47,31.09 ATA6563.1
  Bottom 0.254: v5.69,30.28 5.69,27.64 11.38,21.95 11.38,14.02 RIGHT.11
VDD  (via drill 0.3, 0.35)
  Top 0.254: 45.72,2.69 44.7,3.71 T1.3 | 45.72,2.69 45.72,2.29 46.13,1.88 47.97,1.88 48.97,2.88 48.97,7.01 49.53,7.57 50.8,7.62 51.67,8.49 C19.1 | 45.31,7.57 47.95,7.57 47.95,4.12 47.55,3.71 45.72,3.71 45.72,2.69 | 45.31,7.57 44.7,7.57 T2.3 45.31,7.57 | v44.3,13.87 44.3,11.63 44.5,11.43 T3.3 | v45.31,9.6 45.31,7.57 | 36.58,41.5 v36.58,39.06 36.58,37.85 34.14,37.85 MCP6024.4 | R70.2 46.33,50.39 44.7,48.77 44.7,46.58 44.91,46.38 44.91,45.57 44.5,45.16 44.5,43.74 44.09,43.33 43.69,43.33 R47.2 | 37.72,42.65 37.72,43.17 C28.1 | R12.2 40.84,30.48 v42.06,31.7 | v46.74,37.59 v46.74,34.54 | 42.47,43.18 v42.47,42.88 | 17.68,27.43 12.7,27.43 | 11.43,27.43 10.97,27.43 ATA6563.5
  Top 0.508: R47.2 42.47,43.18 38.25,43.18 37.72,42.65 37.57,42.65 36.58,41.65 36.58,41.5 | v36.58,39.06 36.58,40.09 36.47,40.19 36.47,41.55 36.83,41.91 | v17.68,12.04 17.68,27.43 17.68,27.7 | 17.68,27.7 17.58,27.8 17.58,29.91 17.68,30.02 17.68,33.02 16.38,34.31 16.38,35.66 16.51,35.79 v16.51,39.06 | 17.68,27.7 12.96,27.7 12.7,27.43 11.43,27.43
  Bottom 0.254: 31.75,39.06 29.21,39.06 | v42.06,31.7 43.89,31.7 v46.74,34.54 | v46.74,37.59 48.77,37.59 49.17,38 49.17,40.03 46.33,42.88 v42.47,42.88
  Bottom 0.508: v17.68,12.04 34.9,12.04 RIGHT.1 44.2,13.97 v44.3,13.87 44.3,10.62 v45.31,9.6 | v16.51,39.06 26.83,39.06 26.93,38.96 27.52,38.96 27.62,39.06 29.21,39.06 | v36.58,39.06 33.31,39.06 33.21,38.96 32.62,38.96 32.52,39.06 31.75,39.06
VREF
  Top 0.254: MCP6024.9 39.62,36.42 39.62,36.02 MCP6024.8 39.42,36.02 37.8,36.02 | R52.1 37.59,33.17 37.59,34.19 R51.1 37.8,34.39 37.8,36.02 | 37.8,36.02 37.8,42.11 39.62,42.11 40.03,41.71 40.03,40.69 43.48,40.69 R49.1

## Text on the board
tPlace: + | X2C | UNIVERSAL | MOTOR SHIELD REV.B | GND | EN FLT | GND | DC | OBSRV_1_2_3 | CURRENT | VOLTAGE | LED1-6 | PWM | H3 | L3 | H2 | L2 | H1 | L1 | CANH CANL | Hall/Encoder | GND | +5V | A | B | C | GND | +24V